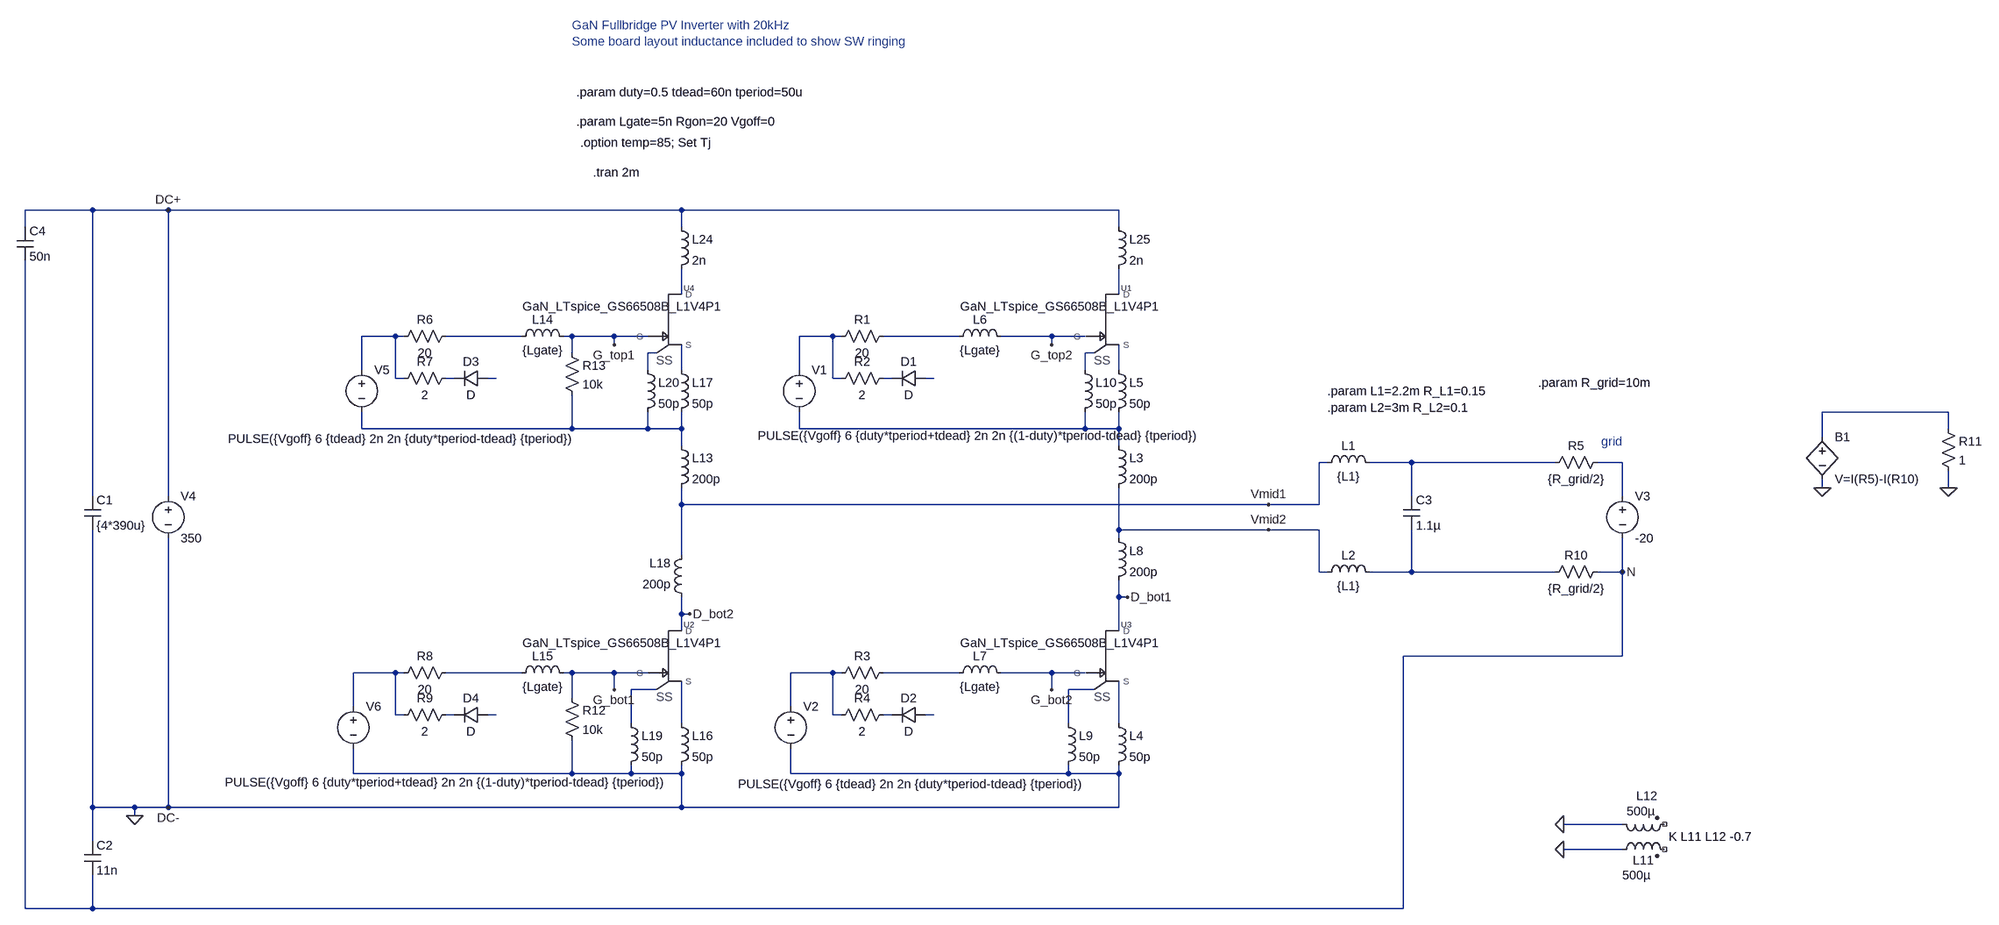
[diagram p0: schematic GaN_FB_LCL_GS66508B.asc]
GaN_FB_LCL_GS66508B.asc, the LTspice schematic file:
Version 4
SHEET 1 3592 792
WIRE -736 -816 -864 -816
WIRE -592 -816 -736 -816
WIRE 384 -816 -592 -816
WIRE 1216 -816 384 -816
WIRE -864 -784 -864 -816
WIRE 384 -784 384 -816
WIRE 1216 -784 1216 -816
WIRE 384 -656 384 -704
WIRE 1216 -656 1216 -704
WIRE -160 -576 -224 -576
WIRE -144 -576 -160 -576
WIRE 80 -576 -64 -576
WIRE 176 -576 160 -576
WIRE 256 -576 176 -576
WIRE 320 -576 256 -576
WIRE 672 -576 608 -576
WIRE 688 -576 672 -576
WIRE 912 -576 768 -576
WIRE 1088 -576 992 -576
WIRE 1152 -576 1088 -576
WIRE 256 -560 256 -576
WIRE 1088 -560 1088 -576
WIRE 176 -544 176 -576
WIRE 336 -544 320 -544
WIRE 1168 -544 1152 -544
WIRE -224 -512 -224 -576
WIRE 320 -512 320 -544
WIRE 384 -512 384 -560
WIRE 608 -512 608 -576
WIRE 1152 -512 1152 -544
WIRE 1216 -512 1216 -560
WIRE -160 -496 -160 -576
WIRE -144 -496 -160 -496
WIRE -48 -496 -64 -496
WIRE 32 -496 16 -496
WIRE 672 -496 672 -576
WIRE 688 -496 672 -496
WIRE 784 -496 768 -496
WIRE 864 -496 848 -496
WIRE 3312 -432 3072 -432
WIRE -224 -400 -224 -432
WIRE 176 -400 176 -464
WIRE 176 -400 -224 -400
WIRE 320 -400 320 -432
WIRE 320 -400 176 -400
WIRE 384 -400 384 -432
WIRE 384 -400 320 -400
WIRE 608 -400 608 -432
WIRE 1152 -400 1152 -432
WIRE 1152 -400 608 -400
WIRE 1216 -400 1216 -432
WIRE 1216 -400 1152 -400
WIRE 3312 -400 3312 -432
WIRE 3072 -384 3072 -432
WIRE 384 -368 384 -400
WIRE 1216 -368 1216 -400
WIRE 1776 -336 1760 -336
WIRE 1936 -336 1856 -336
WIRE 2544 -336 1936 -336
WIRE 2672 -336 2624 -336
WIRE 3072 -288 3072 -304
WIRE 3312 -288 3312 -320
WIRE -736 -272 -736 -816
WIRE -592 -272 -592 -816
WIRE 1936 -272 1936 -336
WIRE 2672 -272 2672 -336
WIRE 384 -256 384 -288
WIRE 1664 -256 384 -256
WIRE 1760 -256 1760 -336
WIRE 1760 -256 1664 -256
WIRE 1216 -208 1216 -288
WIRE 1664 -208 1216 -208
WIRE 1760 -208 1664 -208
WIRE 1216 -192 1216 -208
WIRE 384 -160 384 -256
WIRE 1760 -128 1760 -208
WIRE 1776 -128 1760 -128
WIRE 1936 -128 1936 -208
WIRE 1936 -128 1856 -128
WIRE 2544 -128 1936 -128
WIRE 2672 -128 2672 -192
WIRE 2672 -128 2624 -128
WIRE 1216 -80 1216 -112
WIRE 1232 -80 1216 -80
WIRE 384 -48 384 -80
WIRE 400 -48 384 -48
WIRE 384 -16 384 -48
WIRE 1216 -16 1216 -80
WIRE 2672 32 2672 -128
WIRE 2672 32 1920 32
WIRE -160 64 -240 64
WIRE -144 64 -160 64
WIRE 80 64 -64 64
WIRE 176 64 160 64
WIRE 256 64 176 64
WIRE 320 64 256 64
WIRE 672 64 592 64
WIRE 688 64 672 64
WIRE 912 64 768 64
WIRE 1088 64 992 64
WIRE 1152 64 1088 64
WIRE 256 96 256 64
WIRE 336 96 288 96
WIRE 1088 96 1088 64
WIRE 1168 96 1120 96
WIRE 176 112 176 64
WIRE -240 128 -240 64
WIRE 592 128 592 64
WIRE -160 144 -160 64
WIRE -144 144 -160 144
WIRE -48 144 -64 144
WIRE 32 144 16 144
WIRE 672 144 672 64
WIRE 688 144 672 144
WIRE 784 144 768 144
WIRE 864 144 848 144
WIRE 288 160 288 96
WIRE 384 160 384 80
WIRE 1120 160 1120 96
WIRE 1216 160 1216 80
WIRE -240 256 -240 208
WIRE 176 256 176 192
WIRE 176 256 -240 256
WIRE 288 256 288 240
WIRE 288 256 176 256
WIRE 384 256 384 240
WIRE 384 256 288 256
WIRE 592 256 592 208
WIRE 1120 256 1120 240
WIRE 1120 256 592 256
WIRE 1216 256 1216 240
WIRE 1216 256 1120 256
WIRE -736 320 -736 -208
WIRE -656 320 -736 320
WIRE -592 320 -592 -192
WIRE -592 320 -656 320
WIRE 384 320 384 256
WIRE 384 320 -592 320
WIRE 1216 320 1216 256
WIRE 1216 320 384 320
WIRE -656 336 -656 320
WIRE 2672 352 2560 352
WIRE -736 384 -736 320
WIRE 2672 400 2560 400
WIRE -864 512 -864 -720
WIRE -736 512 -736 448
WIRE -736 512 -864 512
WIRE 1920 512 1920 32
WIRE 1920 512 -736 512
FLAG 1232 -80 D_bot1
FLAG 1088 96 G_bot2
FLAG 1088 -560 G_top2
FLAG 400 -48 D_bot2
FLAG 256 96 G_bot1
FLAG 256 -560 G_top1
FLAG 1664 -208 Vmid2
FLAG 1664 -256 Vmid1
FLAG 3072 -288 0
FLAG 3312 -288 0
FLAG 2560 400 0
FLAG 2560 352 0
FLAG -592 -816 DC+
FLAG -592 320 DC-
FLAG -656 336 0
FLAG 2672 -128 N
SYMBOL voltage 608 -528 R0
WINDOW 3 -79 141 Left 2
WINDOW 123 0 0 Left 2
SYMATTR Value PULSE({Vgoff} 6 {duty*tperiod+tdead} 2n 2n {(1-duty)*tperiod-tdead} {tperiod})
SYMATTR SpiceLine Rser=2
SYMATTR InstName V1
SYMBOL voltage -592 -288 R0
WINDOW 123 0 0 Left 2
SYMATTR SpiceLine Rser=20m
SYMATTR InstName V4
SYMATTR Value 350
SYMBOL voltage 592 112 R0
WINDOW 3 -100 164 Left 2
WINDOW 123 0 0 Left 2
SYMATTR Value PULSE({Vgoff} 6 {tdead} 2n 2n {duty*tperiod-tdead} {tperiod})
SYMATTR SpiceLine Rser=2
SYMATTR InstName V2
SYMBOL ind 1200 -384 R0
SYMATTR InstName L3
SYMATTR Value 200p
SYMATTR SpiceLine Rser=1m
SYMBOL ind 896 -560 R270
WINDOW 0 32 56 VTop 2
WINDOW 3 5 56 VBottom 2
SYMATTR InstName L6
SYMATTR Value {Lgate}
SYMBOL ind 896 80 R270
WINDOW 0 32 56 VTop 2
WINDOW 3 5 56 VBottom 2
SYMATTR InstName L7
SYMATTR Value {Lgate}
SYMBOL ind 1200 144 R0
SYMATTR InstName L4
SYMATTR Value 50p
SYMATTR SpiceLine Rser=1m
SYMBOL ind 1200 -528 R0
SYMATTR InstName L5
SYMATTR Value 50p
SYMATTR SpiceLine Rser=1m
SYMBOL cap -752 -272 R0
SYMATTR InstName C1
SYMATTR Value {4*390u}
SYMATTR SpiceLine Rser=20m
SYMBOL ind 1200 -208 R0
SYMATTR InstName L8
SYMATTR Value 200p
SYMATTR SpiceLine Rser=1m
SYMBOL GaN_LTspice_GS66508B_L1V4P1 1168 32 R0
SYMATTR InstName U3
SYMBOL ind 1104 144 R0
SYMATTR InstName L9
SYMATTR Value 50p
SYMBOL ind 1136 -528 R0
SYMATTR InstName L10
SYMATTR Value 50p
SYMBOL GaN_LTspice_GS66508B_L1V4P1 1168 -608 R0
SYMATTR InstName U1
SYMBOL res 784 -592 R90
WINDOW 0 0 56 VBottom 2
WINDOW 3 32 56 VTop 2
SYMATTR InstName R1
SYMATTR Value 20
SYMBOL res 784 -512 R90
WINDOW 0 0 56 VBottom 2
WINDOW 3 32 56 VTop 2
SYMATTR InstName R2
SYMATTR Value 2
SYMBOL diode 848 -512 R90
WINDOW 0 0 32 VBottom 2
WINDOW 3 32 32 VTop 2
SYMATTR InstName D1
SYMBOL res 784 48 R90
WINDOW 0 0 56 VBottom 2
WINDOW 3 32 56 VTop 2
SYMATTR InstName R3
SYMATTR Value 20
SYMBOL res 784 128 R90
WINDOW 0 0 56 VBottom 2
WINDOW 3 32 56 VTop 2
SYMATTR InstName R4
SYMATTR Value 2
SYMBOL diode 848 128 R90
WINDOW 0 0 32 VBottom 2
WINDOW 3 32 32 VTop 2
SYMATTR InstName D2
SYMBOL ind2 2656 416 R270
WINDOW 0 -20 56 VTop 2
WINDOW 3 -17 43 VBottom 2
SYMATTR InstName L11
SYMATTR Value 500µ
SYMATTR Type ind
SYMATTR SpiceLine Rser=0.01
SYMBOL ind2 2656 336 M90
WINDOW 0 -22 63 VBottom 2
WINDOW 3 -24 51 VTop 2
SYMATTR InstName L12
SYMATTR Value 500µ
SYMATTR Type ind
SYMATTR SpiceLine Rser=0.01
SYMBOL voltage -224 -528 R0
WINDOW 3 -254 147 Left 2
WINDOW 123 0 0 Left 2
SYMATTR Value PULSE({Vgoff} 6 {tdead} 2n 2n {duty*tperiod-tdead} {tperiod})
SYMATTR SpiceLine Rser=2
SYMATTR InstName V5
SYMBOL voltage -240 112 R0
WINDOW 3 -244 160 Left 2
WINDOW 123 0 0 Left 2
SYMATTR Value PULSE({Vgoff} 6 {duty*tperiod+tdead} 2n 2n {(1-duty)*tperiod-tdead} {tperiod})
SYMATTR SpiceLine Rser=2
SYMATTR InstName V6
SYMBOL ind 368 -384 R0
SYMATTR InstName L13
SYMATTR Value 200p
SYMATTR SpiceLine Rser=1m
SYMBOL ind 64 -560 R270
WINDOW 0 32 56 VTop 2
WINDOW 3 5 56 VBottom 2
SYMATTR InstName L14
SYMATTR Value {Lgate}
SYMBOL ind 64 80 R270
WINDOW 0 32 56 VTop 2
WINDOW 3 5 56 VBottom 2
SYMATTR InstName L15
SYMATTR Value {Lgate}
SYMBOL ind 368 144 R0
SYMATTR InstName L16
SYMATTR Value 50p
SYMATTR SpiceLine Rser=1m
SYMBOL ind 368 -528 R0
SYMATTR InstName L17
SYMATTR Value 50p
SYMATTR SpiceLine Rser=1m
SYMBOL ind 400 -64 R180
WINDOW 0 36 80 Left 2
WINDOW 3 36 40 Left 2
SYMATTR InstName L18
SYMATTR Value 200p
SYMATTR SpiceLine Rser=1m
SYMBOL GaN_LTspice_GS66508B_L1V4P1 336 32 R0
SYMATTR InstName U2
SYMBOL ind 272 144 R0
SYMATTR InstName L19
SYMATTR Value 50p
SYMBOL ind 304 -528 R0
SYMATTR InstName L20
SYMATTR Value 50p
SYMBOL GaN_LTspice_GS66508B_L1V4P1 336 -608 R0
SYMATTR InstName U4
SYMBOL res -48 -592 R90
WINDOW 0 0 56 VBottom 2
WINDOW 3 32 56 VTop 2
SYMATTR InstName R6
SYMATTR Value 20
SYMBOL res -48 -512 R90
WINDOW 0 0 56 VBottom 2
WINDOW 3 32 56 VTop 2
SYMATTR InstName R7
SYMATTR Value 2
SYMBOL diode 16 -512 R90
WINDOW 0 0 32 VBottom 2
WINDOW 3 32 32 VTop 2
SYMATTR InstName D3
SYMBOL res -48 48 R90
WINDOW 0 0 56 VBottom 2
WINDOW 3 32 56 VTop 2
SYMATTR InstName R8
SYMATTR Value 20
SYMBOL res -48 128 R90
WINDOW 0 0 56 VBottom 2
WINDOW 3 32 56 VTop 2
SYMATTR InstName R9
SYMATTR Value 2
SYMBOL diode 16 128 R90
WINDOW 0 0 32 VBottom 2
WINDOW 3 32 32 VTop 2
SYMATTR InstName D4
SYMBOL ind 1760 -320 R270
WINDOW 0 32 56 VTop 2
WINDOW 3 5 56 VBottom 2
SYMATTR InstName L1
SYMATTR Value {L1}
SYMATTR SpiceLine Rser={R_L1}
SYMBOL ind 1760 -112 R270
WINDOW 0 32 56 VTop 2
WINDOW 3 5 56 VBottom 2
SYMATTR InstName L2
SYMATTR Value {L1}
SYMATTR SpiceLine Rser={R_L1}
SYMBOL res 2640 -352 R90
WINDOW 0 0 56 VBottom 2
WINDOW 3 32 56 VTop 2
SYMATTR InstName R5
SYMATTR Value {R_grid/2}
SYMBOL res 2528 -112 R270
WINDOW 0 32 56 VTop 2
WINDOW 3 0 56 VBottom 2
SYMATTR InstName R10
SYMATTR Value {R_grid/2}
SYMBOL bv 3072 -400 R0
SYMATTR InstName B1
SYMATTR Value V=I(R5)-I(R10)
SYMBOL res 3296 -416 R0
SYMATTR InstName R11
SYMATTR Value 1
SYMBOL ind 368 -800 R0
SYMATTR InstName L24
SYMATTR Value 2n
SYMATTR SpiceLine Rser=1m
SYMBOL ind 1200 -800 R0
SYMATTR InstName L25
SYMATTR Value 2n
SYMATTR SpiceLine Rser=1m
SYMBOL res 160 96 R0
SYMATTR InstName R12
SYMATTR Value 10k
SYMBOL res 160 -560 R0
SYMATTR InstName R13
SYMATTR Value 10k
SYMBOL voltage 2672 -288 R0
WINDOW 123 0 0 Left 2
SYMATTR SpiceLine Rser=20m
SYMATTR InstName V3
SYMATTR Value -20
SYMBOL cap -752 384 R0
SYMATTR InstName C2
SYMATTR Value 11n
SYMBOL cap 1920 -272 R0
SYMATTR InstName C3
SYMATTR Value 1.1µ
SYMBOL cap -880 -784 R0
SYMATTR InstName C4
SYMATTR Value 50n
TEXT 216 -888 Left 2 !.tran 2m
TEXT 184 -1040 Left 2 !.param duty=0.5 tdead=60n tperiod=50u
TEXT 2760 376 Left 2 !K L11 L12 -0.7
TEXT 1776 -472 Left 2 !.param L1=2.2m R_L1=0.15
TEXT 2632 -376 Left 2 ;grid
TEXT 2512 -488 Left 2 !.param R_grid=10m
TEXT 1776 -440 Left 2 !.param L2=3m R_L2=0.1
TEXT 176 -1168 Left 2 ;GaN Fullbridge PV Inverter with 20kHz\nSome board layout inductance included to show SW ringing
TEXT 184 -984 Left 2 !.param Lgate=5n Rgon=20 Vgoff=0
TEXT 192 -944 Left 2 !.option temp=85; Set Tj

The netlist it stands for:
* GaN_FB_LCL_GS66508B.asc
V1 N005 N017 PULSE({Vgoff} 6 {duty*tperiod+tdead} 2n 2n {(1-duty)*tperiod-tdead} {tperiod}) Rser=2
V4 DC+ 0 350 Rser=20m
V2 N023 0 PULSE({Vgoff} 6 {tdead} 2n 2n {duty*tperiod-tdead} {tperiod}) Rser=2
L3 N017 Vmid2 200p Rser=1m
L6 N006 G_top2 {Lgate}
L7 N024 G_bot2 {Lgate}
L4 N032 0 50p Rser=1m
L5 N010 N017 50p Rser=1m
C1 DC+ 0 {4*390u} Rser=20m
L8 Vmid2 D_bot1 200p Rser=1m
XU3 G_bot2 D_bot1 N032 N026 GaN_LTspice_GS66508B_L1V4P1  ; pins G D S SS
L9 N026 0 50p
L10 N008 N017 50p
XU1 G_top2 N002 N010 N008 GaN_LTspice_GS66508B_L1V4P1  ; pins G D S SS
R1 N006 N005 20
R2 N013 N005 2
D1 N014 N013 D
R3 N024 N023 20
R4 N029 N023 2
D2 N030 N029 D
L11 0 NC_01 500µ Rser=0.01
L12 0 NC_02 500µ Rser=0.01
V5 N003 N016 PULSE({Vgoff} 6 {tdead} 2n 2n {duty*tperiod-tdead} {tperiod}) Rser=2
V6 N021 0 PULSE({Vgoff} 6 {duty*tperiod+tdead} 2n 2n {(1-duty)*tperiod-tdead} {tperiod}) Rser=2
L13 N016 Vmid1 200p Rser=1m
L14 N004 G_top1 {Lgate}
L15 N022 G_bot1 {Lgate}
L16 N031 0 50p Rser=1m
L17 N009 N016 50p Rser=1m
L18 D_bot2 Vmid1 200p Rser=1m
XU2 G_bot1 D_bot2 N031 N025 GaN_LTspice_GS66508B_L1V4P1  ; pins G D S SS
L19 N025 0 50p
L20 N007 N016 50p
XU4 G_top1 N001 N009 N007 GaN_LTspice_GS66508B_L1V4P1  ; pins G D S SS
R6 N004 N003 20
R7 N011 N003 2
D3 N012 N011 D
R8 N022 N021 20
R9 N027 N021 2
D4 N028 N027 D
L1 Vmid1 N018 {L1} Rser={R_L1}
L2 Vmid2 N020 {L1} Rser={R_L1}
R5 N019 N018 {R_grid/2}
R10 N020 N {R_grid/2}
B1 N015 0 V=I(R5)-I(R10)
R11 N015 0 1
L24 DC+ N001 2n Rser=1m
L25 DC+ N002 2n Rser=1m
R12 G_bot1 0 10k
R13 G_top1 N016 10k
V3 N019 N -20 Rser=20m
C2 0 N 11n
C3 N018 N020 1.1µ
C4 DC+ N 50n
.model D D
.lib standard.dio
.tran 2m
.param duty=0.5 tdead=60n tperiod=50u
K L11 L12 -0.7
.param L1=2.2m R_L1=0.15
* grid
.param R_grid=10m
.param L2=3m R_L2=0.1
* GaN Fullbridge PV Inverter with 20kHz
* Some board layout inductance included to show SW ringing
.param Lgate=5n Rgon=20 Vgoff=0
.option temp=85; Set Tj
.lib GaN_LTspice_GS66508B_L1V4P1.lib
.backanno
.end